# EAGLE design schematic (EAGLE 7.5.0)
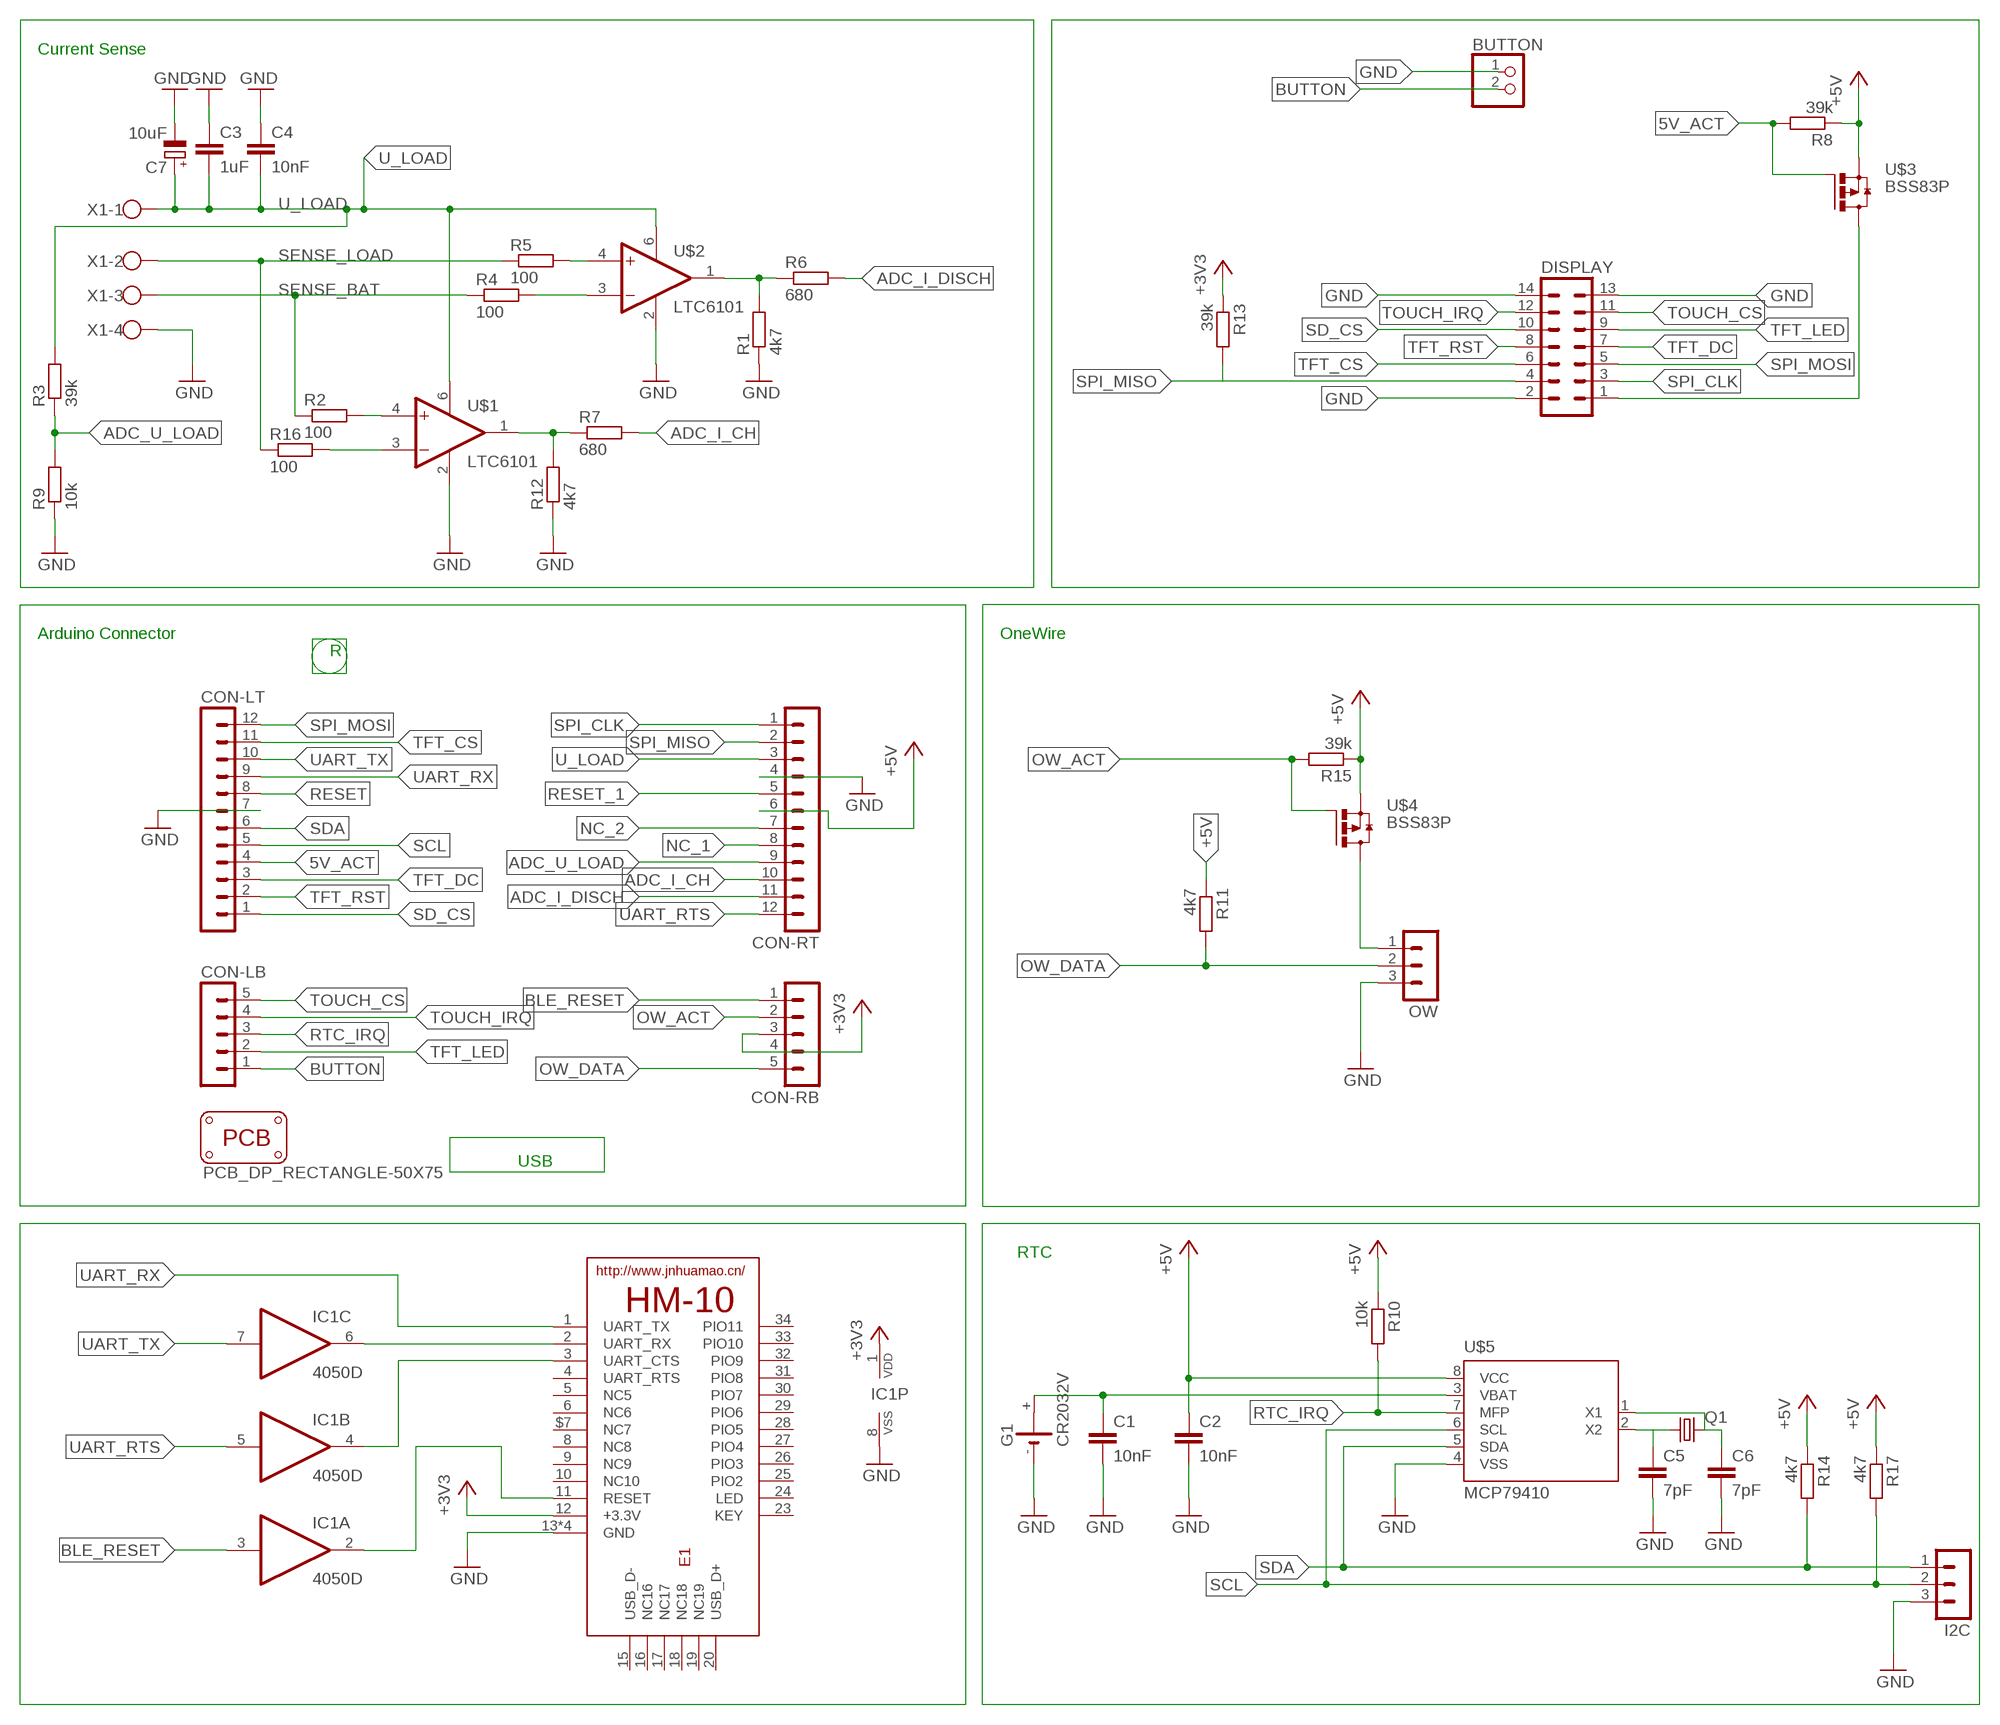
[diagram p0: schematic, sheet 1]

## Parts
BUTTON  PINHD-1X2  [1X02]
C1  10nF  C-EUC1206  [C1206]
C2  10nF  C-EUC1206  [C1206]
C3  1uF  C-EUC1206  [C1206]
C4  10nF  C-EUC1206  [C1206]
C5  7pF  C-EUC1206  [C1206]
C6  7pF  C-EUC1206  [C1206]
C7  10uF  CPOL-EUB  [PANASONIC_B]
CON-LB  MA05-1  [MA05-1]
CON-LT  MA12-1  [MA12-1]
CON-RB  MA05-1  [MA05-1]
CON-RT  MA12-1  [MA12-1]
DISPLAY  MA07-2  [MA07-2]
E1  HM-10-BOARD  [26.9X13X2.2_BOARD]
G1  CR2032V  [CR2032V]
I2C  MA03-1  [MA03-1]
IC1  4050D  [SO16]
OW  MA03-1  [MA03-1]
PCB1  PCB_DP_RECTANGLE-50X75  [DP5075_V1]
Q1  CRYSTALTC26H  [TC26H]
R1  4k7  R-EU_R1206  [R1206]
R2  100  R-EU_R1206  [R1206]
R3  39k  R-EU_R1206  [R1206]
R4  100  R-EU_R1206  [R1206]
R5  100  R-EU_R1206  [R1206]
R6  680  R-EU_R1206  [R1206]
R7  680  R-EU_R1206  [R1206]
R8  39k  R-EU_R1206  [R1206]
R9  10k  R-EU_R1206  [R1206]
R10  10k  R-EU_R1206  [R1206]
R11  4k7  R-EU_R1206  [R1206]
R12  4k7  R-EU_R1206  [R1206]
R13  39k  R-EU_R1206  [R1206]
R14  4k7  R-EU_R1206  [R1206]
R15  39k  R-EU_R1206  [R1206]
R16  100  R-EU_R1206  [R1206]
R17  4k7  R-EU_R1206  [R1206]
U$1  LTC6101  [TSOT23-6]
U$2  LTC6101  [TSOT23-6]
U$3  BSS83P  [SOT23]
U$4  BSS83P  [SOT23]
U$5  MCP79410  [SOIC8]
X1  W237-4  [W237-4]

## Nets
5V_ACT: CON-LT.4 R8.2 U$3.1(G)
+3V3: CON-RB.3 CON-RB.4 E1.12(+3.3V) IC1.1(P:VDD) R13.1
+5V: C2.1 CON-RT.6 R8.1 R10.1 R11.1 R14.1 R15.1 R17.1 U$3.2(S) U$4.2(S) U$5.8(VCC)
ADC_I_CH: CON-RT.10 R7.2
ADC_I_CH_UNPROT: R7.1 R12.2 U$1.1(OUT1)
ADC_I_DISCH: CON-RT.11 R6.2
ADC_I_DISCH_UNPROT: R1.2 R6.1 U$2.1(OUT1)
ADC_U_LOAD: CON-RT.9 R3.1 R9.2
BLE_RESET: CON-RB.1 IC1.3(A:I)
BUTTON: BUTTON.2 CON-LB.1
GND: BUTTON.1 C1.2 C2.2 C3.1 C4.1 C5.2 C6.2 C7.- CON-LT.7 CON-RT.4 DISPLAY.2 DISPLAY.13 DISPLAY.14 E1.13(GND) E1.14(GND) E1.21(GND) E1.22(GND) G1.- I2C.3 IC1.8(P:VSS) OW.3 R1.1 R9.1 R12.1 U$1.2(V-) U$2.2(V-) U$5.4(VSS) X1.4
LCD_5V: DISPLAY.1 U$3.3(D)
N$3: R5.2 U$2.4(+IN)
N$4: R4.2 U$2.3(-IN)
N$7: R2.2 U$1.4(+IN)
N$8: R16.2 U$1.3(-IN)
N$10: E1.3(UART_CTS) IC1.4(B:O)
N$11: E1.2(UART_RX) IC1.6(C:O)
N$12: E1.11(RESET) IC1.2(A:O)
N$13: OW.1 U$4.3(D)
N$16: C5.1 Q1.1 U$5.2(X2)
N$18: C6.1 Q1.2 U$5.1(X1)
NC_1: CON-RT.8
NC_2: CON-RT.7
OW_ACT: CON-RB.2 R15.2 U$4.1(G)
OW_DATA: CON-RB.5 OW.2 R11.2
RESET: CON-LT.8
RESET_1: CON-RT.5
RTC_IRQ: CON-LB.3 R10.2 U$5.7(MFP)
SCL: CON-LT.5 I2C.2 R17.2 U$5.6(SCL)
SD_CS: CON-LT.1 DISPLAY.10
SDA: CON-LT.6 I2C.1 R14.2 U$5.5(SDA)
SENSE_BAT: R2.1 R4.1 X1.3
SENSE_LOAD: R5.1 R16.1 X1.2
SPI_CLK: CON-RT.1 DISPLAY.3
SPI_MISO: CON-RT.2 DISPLAY.4 R13.2
SPI_MOSI: CON-LT.12 DISPLAY.5
TFT_CS: CON-LT.11 DISPLAY.6
TFT_DC: CON-LT.3 DISPLAY.7
TFT_LED: CON-LB.2 DISPLAY.9
TFT_RST: CON-LT.2 DISPLAY.8
TOUCH_CS: CON-LB.5 DISPLAY.11
TOUCH_IRQ: CON-LB.4 DISPLAY.12
U_LOAD: C3.2 C4.2 C7.+ CON-RT.3 R3.2 U$1.6(V+) U$2.6(V+) X1.1
UART_RTS: CON-RT.12 IC1.5(B:I)
UART_RX: CON-LT.9 E1.1(UART_TX)
UART_TX: CON-LT.10 IC1.7(C:I)
VBAK: C1.1 G1.+ U$5.3(VBAT)
Unconnected: E1.4(UART_RTS) E1.5(NC5) E1.6(NC6) E1.8(NC8) E1.9(NC9) E1.10(NC10) E1.15(USB_D-) E1.16(NC16) E1.17(NC17) E1.18(NC18) E1.19(NC19) E1.20(USB_D+) E1.23(KEY) E1.24(LED) E1.25(PIO2) E1.26(PIO3) E1.27(PIO4) E1.28(PIO5) E1.29(PIO6) E1.30(PIO7) E1.31(PIO8) E1.32(PIO9) E1.33(PIO10) E1.34(PIO11) E1.$7(NC7) G1.+@1(+) IC1.9(D:I) IC1.10(D:O) IC1.11(E:I) IC1.12(E:O) IC1.14(F:I) IC1.15(F:O)

## Notes on the sheet
- Current Sense
- Arduino Connector | OneWire
- R
- USB
- RTC

## Library data of the parts
BUTTON = pinhead:PINHD-1X2: PIN HEADER
C1-C6 = rcl:C-EU: CAPACITOR, European symbol
C7 = rcl:CPOL-EU: POLARIZED CAPACITOR, European symbol
CON-LB CON-RB = con-lstb:MA05-1: PIN HEADER; OC_FARNELL: unknown; OC_NEWARK: unknown
CON-LT CON-RT = con-lstb:MA12-1: PIN HEADER; OC_FARNELL: unknown; OC_NEWARK: unknown
DISPLAY = con-lstb:MA07-2: PIN HEADER; OC_FARNELL: unknown; OC_NEWARK: unknown
E1 = ble:HM-10: HM Bluetooth module use TI CC2540 or CC2541, Master and slave roles in one, transmission version and remote control version and PIO state acquisition functions in one, Support the AT command modify module parameters, Convenient and flexible.
G1 = battery:CR2032V: LI BATTERY Varta
I2C OW = con-lstb:MA03-1: PIN HEADER; OC_FARNELL: unknown; OC_NEWARK: unknown
IC1 = 40xx:4050: Hex non-inverting BUFFER
PCB1 = dp_pcb:PCB_DP_RECTANGLE: Dangerous Prototypes Standard Rectangular PCB sizes
Q1 = crystal:CRYSTAL: CRYSTAL; OC_FARNELL: unknown; OC_NEWARK: unknown
R1-R17 = resistor:R-EU_: RESISTOR, European symbol
U$1 U$2 = custom_devices:LTC6101
U$3 U$4 = custom_devices:BSS83P
U$5 = custom_devices:MCP79410
X1 = con-wago-500:W237-4: WAGO SCREW CLAMP; OC_FARNELL: unknown; OC_NEWARK: unknown

## Net classes
0 default: clearance 0.205 mm

## Board
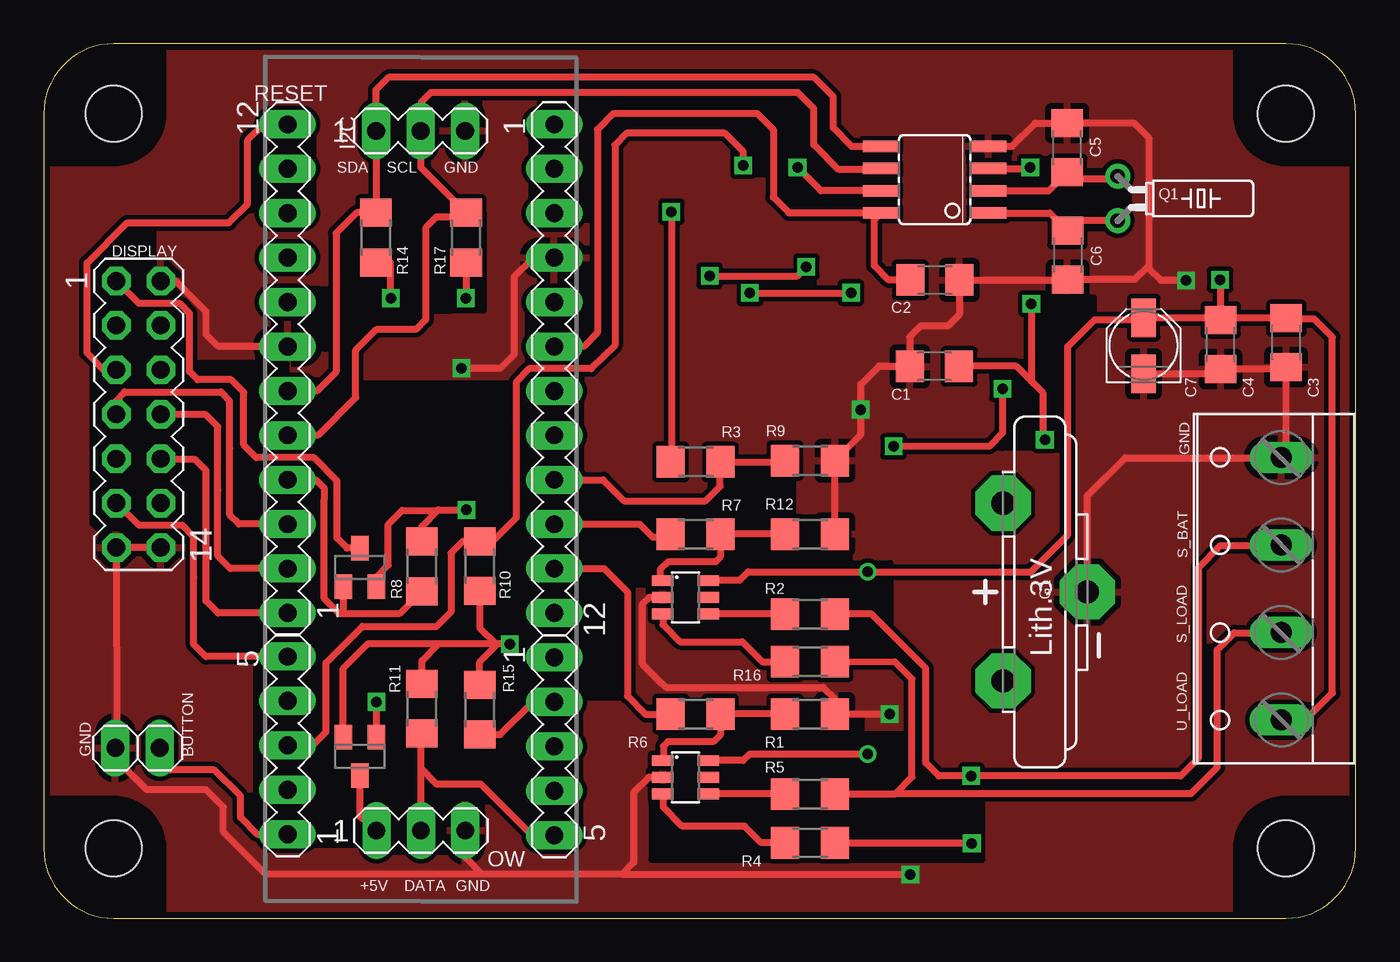
[diagram p1: board, top side]
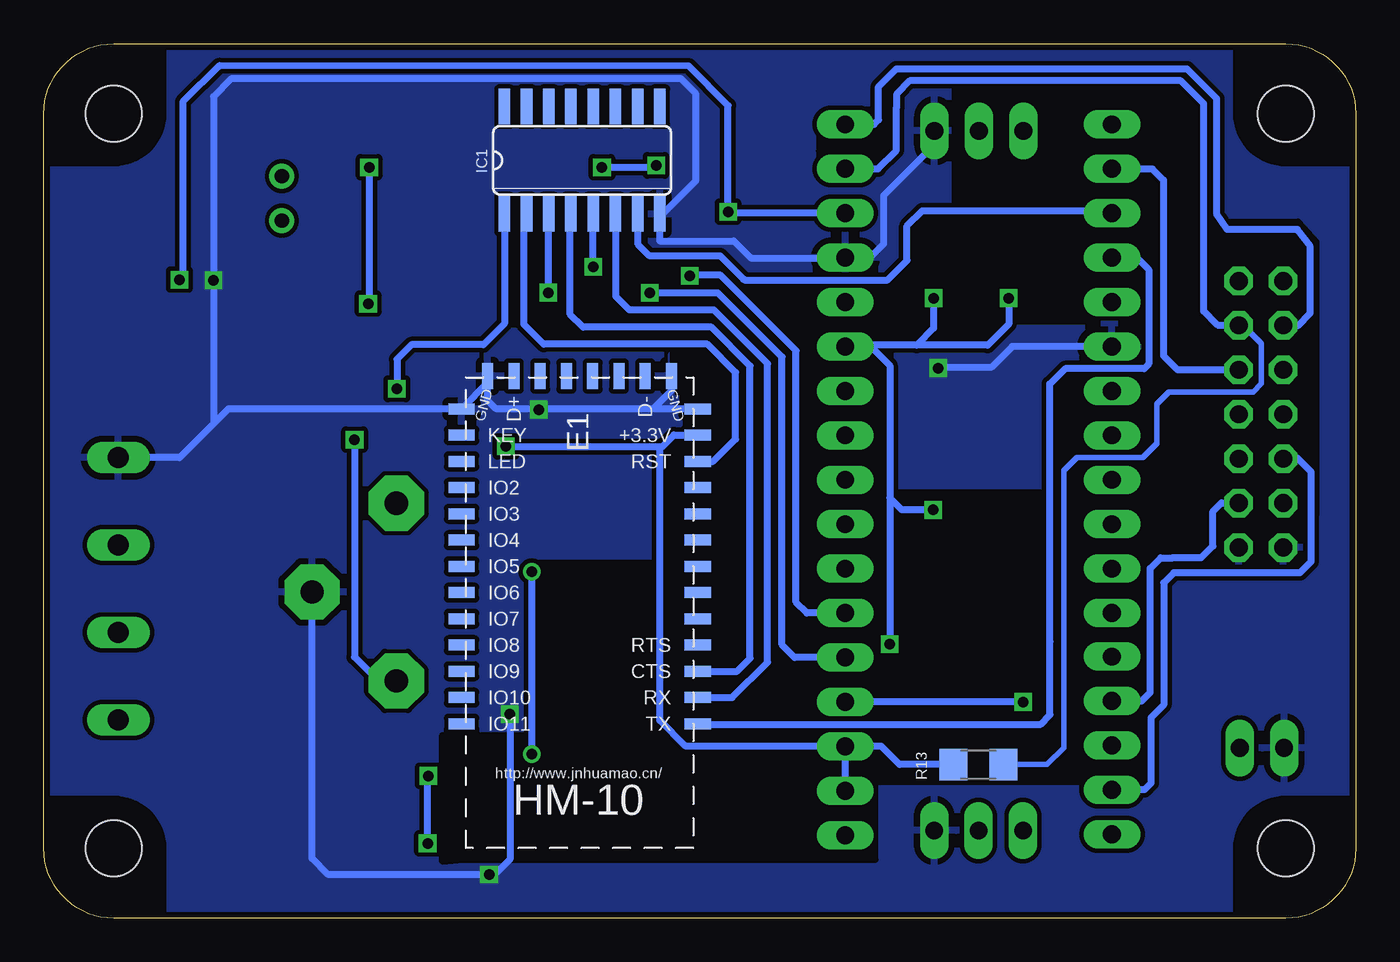
[diagram p2: board, bottom side, seen from below]

Size 75 x 50 mm. Coordinates in mm from the lower left corner, seen from the top.
Copper layers (1*16): Top 0.035mm / dielectric 1.5mm / Bottom 0.035mm
Design rules "ITEADstudio_DRC_increased": minimum track width 10mil, minimum drill 16mil, track to track 10mil, track to pad 10mil, pad to pad 10mil, via to via 10mil, smd to smd 0mil, copper to edge 14mil, drill to drill 14mil, minimum pad ring 12mil, minimum via ring 8mil, stop-mask expansion 6mil, vias tented up to drill 100mil, thermal gap 14mil
tRestrict: area 2.8,22.3 to 13.9,39.8; area 11.8,40.6 to 15.4,45.1; area 14.7,32.6 to 16.7,36; area 12.2,3.8 to 30.7,23.1; area 14.4,20.4 to 30.7,30.7; area 27.9,40.5 to 31.5,45.1; area 27.6,32.9 to 31.6,35.1; area 21.5,34.7 to 25.1,40.4; area 30.6,19.1 to 35.4,22.4; area 30.5,12.6 to 33.3,19.1; area 38.9,42.6 to 41.8,46; area 57.1,39.5 to 62,42.7; area 56.6,27.8 to 60,35.5; area 54.8,26.9 to 57.1,30.9; area 38.7,17.5 to 46,22.1; area 38.2,22 to 42.8,26.1; area 42.6,21.8 to 44.4,22.9; area 35.9,10.7 to 38.2,12.5; area 35.5,13.8 to 48.4,20.5; area 35.7,4.2 to 53.2,11.6; area 46.7,7.1 to 49.7,10.6; area 43,11.2 to 44.5,12.5; area 34.8,3.4 to 53.6,6.7
bRestrict: area 20.2,7.9 to 23.3,10.3; area 2.3,12.9 to 22.9,47.5; area 26.7,43 to 30.7,45.9; area 15.1,32.8 to 26.8,40.1; area 11.5,10.4 to 39.1,33.4; area 12,7.5 to 30.7,10.5; area 27.5,3.3 to 52.2,20.3

### Footprints (pad centres in the part's own frame; a part is rotated, then mirrored left to right if it is on the bottom)
1X02 = drill 1.016 long: 1 -1.27,0; 2 1.27,0
C1206 = smd 1.6 x 1.8: 1 -1.4,0; 2 1.4,0
PANASONIC_B = smd 2.2 x 1.4: + 1.6,0; - -1.6,0
MA05-1 = drill 1.016 long: 1 -5.08,0; 2 -2.54,0; 3 0,0; 4 2.54,0; 5 5.08,0
MA12-1 = drill 1.016 long: 1 -13.97,0; 2 -11.43,0; 3 -8.89,0; 4 -6.35,0; 5 -3.81,0; 6 -1.27,0; 7 1.27,0; 8 3.81,0; 9 6.35,0; 10 8.89,0; 11 11.43,0; 12 13.97,0
MA07-2 = drill 1.016 octagon: 1 -7.62,-1.27; 2 -7.62,1.27; 3 -5.08,-1.27; 4 -5.08,1.27; 5 -2.54,-1.27; 6 -2.54,1.27; 7 0,-1.27; 8 0,1.27; 9 2.54,-1.27; 10 2.54,1.27; 11 5.08,-1.27; 12 5.08,1.27; 13 7.62,-1.27; 14 7.62,1.27
26.9X13X2.2_BOARD = smd 1.5 x 0.635: 1 -7.5,0; 2 -7.5,-1.5; 3 -7.5,-3; 4 -7.5,-4.5; 5 -7.5,-6; 6 -7.5,-7.5; 8 -7.5,-10.5; 9 -7.5,-12; 10 -7.5,-13.5; 11 -7.5,-15; 12 -7.5,-16.5; 13 -7.5,-18; 22 6,-18; 23 6,-16.5; 24 6,-15; 25 6,-13.5; 26 6,-12; 27 6,-10.5; 28 6,-9; 29 6,-7.5; 30 6,-6; 31 6,-4.5; 32 6,-3; 33 6,-1.5; 34 6,0; $7 -7.5,-9 | smd 0.635 x 1.5: 14 -6,-19.875; 15 -4.5,-19.875; 16 -3,-19.875; 17 -1.5,-19.875; 18 0,-19.875; 19 1.5,-19.875; 20 3,-19.875; 21 4.5,-19.875
CR2032V = drill 1.321 pad 3.15 octagon: + -2.54,-5.08; +@1 -2.54,5.08; - 2.286,0
MA03-1 = drill 1.016 long: 1 -2.54,0; 2 0,0; 3 2.54,0
SO16 = smd 0.66 x 2.032: 1 -4.445,-3.073; 2 -3.175,-3.073; 3 -1.905,-3.073; 4 -0.635,-3.073; 5 0.635,-3.073; 6 1.905,-3.073; 7 3.175,-3.073; 8 4.445,-3.073; 9 4.445,3.073; 10 3.175,3.073; 11 1.905,3.073; 12 0.635,3.073; 13 -0.635,3.073; 14 -1.905,3.073; 15 -3.175,3.073; 16 -4.445,3.073
DP5075_V1 = hole 3.2: -45.53,-21.4; 21.47,-21.4; 21.47,20.6; -45.53,20.6
TC26H = drill 0.813: 1 -1.27,0; 2 1.27,0
R1206 = smd 1.6 x 1.803: 1 -1.422,0; 2 1.422,0
TSOT23-6 = smd 0.62 x 1.22: 1 -0.95,-1.3; 2 0,-1.3; 3 0.95,-1.3; 4 0.95,1.3; 5 0,1.3; 6 -0.95,1.3
SOT23 = smd 1 x 1.4: 1 -0.95,-1.1; 2 0.95,-1.1; 3 0,1.1
SOIC8 = smd 0.66 x 2.032: 1 -1.905,-3.073; 2 -0.635,-3.073; 3 0.635,-3.073; 4 1.905,-3.073; 5 1.905,3.073; 6 0.635,3.073; 7 -0.635,3.073; 8 -1.905,3.073
W237-4 = drill 1.194 long: 1 -7.5,-1.27; 2 -2.5,-1.27; 3 2.5,-1.27; 4 7.5,-1.27

### Placement (x,y rotation side)
BUTTON  5.36,9.74 0 top
C1  50.91,31.55 180 top
C2  50.94,36.49 0 top
C3  71.03,32.91 90 top
C4  67.28,32.8 90 top
C5  58.51,44.06 90 top
C6  58.52,37.91 270 top
C7  62.87,32.74 90 top
CON-LB  13.94,9.88 90 top
CON-LT  13.94,31.42 90 top
CON-RB  29.18,9.83 270 top
CON-RT  29.18,31.42 270 top
DISPLAY  5.42,28.82 270 top
E1  45.12,11.12 180 bottom
G1  57.38,18.65 0 top
I2C  21.54,45.02 0 top
IC1  44.22,43.33 0 bottom
OW  21.56,5.02 0 top
PCB1  49.53,25.4 0 top
Q1  61.39,41.15 270 top
R1  43.8,11.68 180 top
R2  43.8,17.4 180 top
R3  37.26,26.1 180 top
R4  43.8,4.32 180 top
R5  43.8,7.11 180 top
R6  37.26,11.68 180 top
R7  37.26,21.97 180 top
R8  21.62,20.12 270 top
R9  43.8,26.16 180 top
R10  24.93,20.13 90 top
R11  21.62,11.99 270 top
R12  43.8,21.97 180 top
R13  21.56,8.79 0 bottom
R14  18.98,38.92 90 top
R15  24.93,11.93 270 top
R16  43.8,14.67 180 top
R17  24.14,38.92 90 top
U$1  36.69,18.35 270 top
U$2  36.69,8.06 270 top
U$3  18.07,20.06 0 top
U$4  18.07,9.26 180 top
U$5  50.93,42.23 90 top
X1  69.46,18.83 90 top

### Tracks (layer width: path | path; a pad name or v marks a point on that pad's centre or on a via)
5V_ACT
  Top 0.406: R8.2 20.37,17.44 17.05,17.44 | CON-LT.4 13.95,25.06 15.58,25.06 16.04,24.6 16.04,23.95 16.04,18.28 16.85,17.47 16.85,17.44 17.05,17.44 | U$3.1 | 17.13,18.95 U$3.1 | U$3.1 17.12,17.51 17.05,17.44
+3V3  (via drill 0.6)
  Top 0.406: v54.81,30.27 54.81,27.75 54.05,26.98 v48.58,26.98
  Bottom 0.406: CON-RB.4 CON-RB.3 29.83,9.83 | 29.83,9.83 38.3,9.83 39.78,11.3 39.78,26.84 39.64,26.98 | 39.64,26.98 38.98,27.64 37.64,27.64 E1.12 | IC1.1 48.67,33.99 49.86,32.8 53.98,32.8 54.81,31.97 v54.81,30.27 | v48.58,26.98 39.64,26.98 | R13.1 26.07,8.79 27.13,9.84 29.82,9.84 29.83,9.83
+5V  (via drill 0.6)
  Top 0.406: v26.64,15.67 25.94,15.67 | 25.94,15.67 25.87,15.67 | 25.87,15.67 22.58,15.67 | 22.58,15.67 18.51,15.67 17.12,14.28 U$4.2 | R15.1 24.93,14.66 25.94,15.67 | R11.1 21.62,14.72 22.58,15.67 | R14.1 19.8,37.5 19.8,35.49 v19.84,35.46 | 29.21,32.66 CON-RT.6 | 49.4,35.8 C2.1 48.3,36.49 47.48,37.31 47.48,39.94 U$5.8 47.84,40.33 42.59,40.33 41.7,41.22 41.7,45.09 40.78,46.02 32.57,46.02 31.65,45.09 31.65,33.47 30.88,32.7 29.19,32.7 CON-RT.6 | R17.1 v24.14,35.46 | 22.6,23.34 22.56,23.34 21.62,22.41 R8.1 | 22.6,23.34 v24.15,23.34 | R10.1 24.93,16.61 25.87,15.67 | U$3.2 19.02,19.52 19.69,20.2 19.69,22.53 20.49,23.33 22.58,23.33 22.6,23.34 | 29.22,32.73 CON-RT.6
  Bottom 0.406: 26.64,24.04 26.64,31.61 27.72,32.69 CON-RT.6 29.1,32.77 25.1,32.77 | 26.64,24.04 v26.64,15.67 | v19.84,35.46 19.84,33.96 21.03,32.77 25.1,32.77 | v24.14,35.46 24.14,33.73 25.1,32.77 | v24.15,23.34 25.95,23.34 26.64,24.04
ADC_I_CH
  Top 0.406: 35.27,21.4 R7.2 35.66,21.79 34.8,21.79 34.07,22.53 CON-RT.10
ADC_I_CH_UNPROT
  Top 0.406: R12.2 R7.1 38.68,20.66 38.41,20.38 35.69,20.38 35.23,19.94 35.23,19.46 U$1.1
ADC_I_DISCH
  Top 0.406: R6.2 35.8,11.64 34.43,11.64 33.36,12.71 33.36,18.66 32.03,19.99 CON-RT.11
ADC_I_DISCH_UNPROT
  Top 0.406: R1.2 R6.1 38.68,10.5 38.28,10.09 35.67,10.09 35.42,9.84 35.42,9.04 U$2.1
ADC_U_LOAD
  Top 0.406: R9.2 42.32,26.1 R3.1 38.66,26.07 38.66,24.7 37.83,23.87 33.18,23.87 31.98,25.07 CON-RT.9
BLE_RESET  (via drill 0.6)
  Top 0.406: v40.36,35.75 46.08,35.75 v46.15,35.77
  Bottom 0.406: CON-RB.1 32.07,14.91 32.79,15.63 32.79,32.1 36.46,35.75 v40.36,35.75 | v46.15,35.77 46.15,40.24 IC1.3
BUTTON
  Top 0.406: CON-LB.1 12.2,4.8 11.25,5.76 11.25,6.99 9.75,8.48 7.22,8.48 6.68,9.02 6.68,9.69 BUTTON.2
GND  (via drill 0.6)
  Top 0.406: R12.1 R9.1 46.71,27.65 v46.71,29.08 46.71,30.52 47.77,31.58 49.48,31.58 C1.2 49.5,31.56 49.5,33.25 50.12,33.87 51.68,33.87 52.34,34.52 C2.2 58.5,36.49 C6.2 58.53,36.52 62.36,36.52 63.13,37.3 | G1.- 59.67,24.17 61.82,26.33 X1.4 71.04,26.64 C3.1 70.92,31.4 C4.1 67.02,31.14 C7.- | 53.93,44.2 U$5.4 55.35,44.13 56.69,45.46 C5.2 | 58.57,45.4 C5.2 | CON-RT.4 29.08,37.67 27.87,37.67 26.91,36.7 26.91,32.25 26.11,31.46 v23.87,31.46 | DISPLAY.14 DISPLAY.13 4.17,9.81 BUTTON.1 4.09,9.15 5.9,7.35 9.27,7.35 10.26,6.36 10.26,4.96 12.69,2.53 25.06,2.53 | C5.2 58.53,45.48 62.31,45.48 63.17,44.61 63.17,37.34 | U$1.2 34.62,18.35 34.2,17.93 34.2,14.54 35.32,13.43 35.35,13.43 35.58,13.2 44.55,13.2 45.22,12.53 R1.1 | R1.1 | R1.1 48.34,11.68 v48.36,11.67 | U$2.2 34.59,8.06 33.72,7.19 33.72,3.2 33.05,2.53 | 33.05,2.53 25.06,2.53 | 25.06,2.53 24.13,3.45 24.13,4.98 OW.3 | 33.05,2.53 49.51,2.53 v49.54,2.49 | 63.17,37.34 63.13,37.3 | 63.13,37.3 63.13,37.25 | 63.17,37.34 63.17,37.15 63.84,36.47 v65.29,36.47 | DISPLAY.2 7.54,36.44 9.27,34.71 9.27,33.39 9.94,32.71 13.91,32.71 CON-LT.7
  Bottom 0.406: I2C.3 24.08,44.24 27,41.32 27,38.55 27.87,37.67 29.08,37.67 CON-RT.4 | CON-LT.7 19.63,32.69 20.83,31.49 23.84,31.49 v23.87,31.46 | 29.2,37.79 CON-RT.4 | E1.13 40.18,29.12 | 51.58,29.03 51.65,29.03 51.56,29.12 E1.22 | E1.14 39.12,30.17 40.18,29.12 | IC1.8 39.78,40.11 | 29.28,37.67 CON-RT.4 | CON-RT.4 29.2,37.75 34.58,37.75 35.56,38.72 39.78,38.72 39.78,40.11 | v48.36,11.67 48.36,3.36 49.22,2.49 v49.54,2.49 58.74,2.49 59.67,3.42 G1.- | 39.78,40.11 37.73,42.16 37.73,47.14 38.61,48.02 64.25,48.02 65.29,46.98 v65.29,36.47 65.29,28.27 65.78,27.79 | X1.4 67.23,26.33 64.45,29.12 E1.22 | 40.18,29.12 46.56,29.12 | 46.56,29.12 49.14,29.12 49.62,29.61 E1.21 49.62,30.62 E1.22 | v46.71,29.08 46.6,29.08 46.56,29.12
  pour Bottom: -17.6,-12.42 93.05,-12.42 93.05,65.95 -17.86,65.95
  pour Top: -15.35,61.95 -15.35,-9.42 90.31,-9.42 90.31,62.46
LCD_5V
  Top 0.406: U$3.3 17.33,21.16 16.76,21.73 16.76,25.01 15.44,26.34 12.15,26.34 11.43,27.06 11.43,30.07 10.71,30.8 8.79,30.8 8.33,31.25 8.33,34.58 7.76,35.17 5.43,35.17 DISPLAY.1
N$3
  Top 0.406: R5.2 U$2.4
N$4
  Top 0.406: R4.2 41.01,4.32 40.07,5.27 36.5,5.27 35.42,6.35 35.42,7.08 U$2.3
N$7
  Top 0.406: R2.2 U$1.4
N$8
  Top 0.406: U$1.3 35.39,16.79 36.37,15.81 39.93,15.81 41.07,14.67 R16.2
N$10
  Bottom 0.406: E1.3 35.36,14.12 34.62,14.86 34.62,31.58 36.82,33.79 44.17,33.79 44.91,34.52 44.91,40.21 IC1.4
N$11
  Bottom 0.406: E1.2 35.65,12.62 33.62,14.64 33.62,31.71 36.69,34.78 41.52,34.78 42.29,35.55 42.29,40.23 IC1.6
N$12
  Bottom 0.406: E1.11 36.73,26.12 35.45,27.4 35.45,31.2 37.07,32.82 46.42,32.82 47.55,33.95 47.55,40.11 IC1.2
N$13
  Top 0.406: U$4.3 18.07,5.83 OW.1
N$16
  Top 0.406: U$5.2 57.45,41.59 C5.1 58.87,42.3 61.26,42.3 Q1.1
N$18
  Top 0.406: Q1.2 59.09,39.88 C6.1 57.51,40.32 U$5.1
OW_ACT  (via drill 0.6)
  Top 0.406: R15.2 26.09,10.5 27.97,12.37 CON-RB.2 | U$4.1 v19.02,12.37
  Bottom 0.406: v19.02,12.37 CON-RB.2
OW_DATA
  Top 0.406: CON-RB.5 27.91,4.75 24.99,7.67 22.45,7.67 21.56,8.56 | 21.94,10.44 R11.2 21.56,10.5 21.56,8.56 | OW.2 21.56,8.56
RTC_IRQ  (via drill 0.6)
  Top 0.406: U$5.7 44.43,41.59 v43.09,42.93 | v39.99,43.05 39.99,43.82 38.94,44.87 33.31,44.87 32.64,44.21 32.64,32.74 31.29,31.42 27.75,31.42 27.01,30.65 27.01,22.89 25.57,21.45 25.03,21.45 R10.2 23.95,21.55 23.28,20.88 23.28,17.51 22.46,16.69 18.23,16.69 16.14,14.6 16.14,10.65 15.37,9.88 CON-LB.3
  Bottom 0.406: v43.09,42.93 40.1,42.93 v39.99,43.05
SCL
  Top 0.406: I2C.2 21.55,42.94 R17.2 23.91,40.11 22.45,40.11 21.83,39.48 21.83,34.22 21.28,33.67 20.75,33.67 20.74,33.68 19.03,33.68 17.84,32.48 17.84,29.77 15.7,27.63 13.96,27.63 CON-LT.5 | 21.53,45.43 I2C.2 | U$5.6 47.83,42.84 45.41,42.84 44.03,44.22 44.03,46.29 43.1,47.21 22.12,47.21 21.58,46.67 21.58,45.05 I2C.2
SD_CS
  Top 0.406: DISPLAY.10 6.74,26.22 8.67,26.22 9.28,25.6 9.28,18.14 9.97,17.45 CON-LT.1
SDA
  Top 0.406: CON-LT.6 15.62,30.15 16.71,31.24 16.71,39.17 17.89,40.34 R14.2 19.01,40.36 I2C.1 18.98,45.44 18.98,47.35 19.72,48.08 44.03,48.08 45.13,46.97 45.13,45.19 46.19,44.13 U$5.5
SENSE_BAT  (via drill 0.6)
  Top 0.406: R2.1 47.32,17.4 50.42,14.29 50.42,8.88 51.16,8.14 52.9,8.14 v53.02,8.14 64.99,8.14 66.02,9.17 66.02,20.07 67.26,21.3 70.7,21.3 X1.3 | R4.1 53.03,4.32 v53.06,4.28
  Bottom 0.406: v53.06,4.28 53.06,8.11 v53.02,8.14
SENSE_LOAD
  Top 0.406: R16.1 48.64,14.68 49.64,13.68 49.64,8.07 48.71,7.14 | R5.1 48.68,7.11 48.71,7.14 | 48.71,7.14 65.59,7.14 67.08,8.62 67.08,15.35 68.05,16.32 70.72,16.32 X1.2
SPI_CLK
  Bottom 0.406: 29.16,45.41 CON-RT.1 27.53,45.39 27.27,45.65 27.27,47.55 26.26,48.57 9.64,48.57 7.96,46.87 7.96,40.3 7.36,39.38 3.34,39.38 2.61,38.42 2.61,34.59 3.27,33.9 DISPLAY.3
SPI_MISO
  Bottom 0.305: DISPLAY.4 6.43,33.9 5.4,32.87 5.4,30.57 5.87,30.1 10.69,30.1 11.38,29.41 11.38,27.14 12.17,26.35 15.94,26.35 16.69,25.6 16.69,9.75 17.65,8.79 R13.2
  Bottom 0.406: CON-RT.2 27.31,42.85 26.26,43.9 26.26,46.34 26.25,46.35 26.25,47.1 25.51,47.87 9.99,47.87 8.69,46.58 8.69,34.7 7.91,33.92 6.71,33.92 DISPLAY.4
SPI_MOSI
  Top 0.406: DISPLAY.5 3.44,31.36 2.48,32.32 2.48,37.46 4.78,39.76 10.57,39.76 11.65,40.84 11.67,44.51 12.51,45.35 13.9,45.35 CON-LT.12
TFT_CS
  Bottom 0.406: DISPLAY.6 10.19,31.36 10.99,32.16 10.99,42.21 11.63,42.84 CON-LT.11
TFT_DC
  Top 0.406: DISPLAY.7 4.13,28.83 4.13,29.57 4.63,30.09 10.14,30.09 10.63,29.57 10.63,26.88 10.63,23.06 11.16,22.53 CON-LT.3
TFT_LED
  Bottom 0.406: CON-LB.2 13.93,7.35 12.08,7.35 11.71,7.72 11.71,11.47 10.98,12.2 10.98,19.18 10.41,19.75 3.2,19.75 2.55,20.4 2.55,25.51 3.35,26.31 4.11,26.31 DISPLAY.9
TFT_RST
  Top 0.406: DISPLAY.8 6.72,28.79 9.27,28.79 9.95,28.11 9.95,24.49 9.96,24.48 9.96,20.7 10.67,19.99 CON-LT.2
TOUCH_CS
  Top 0.406: DISPLAY.11 5.45,22.47 7.94,22.47 8.58,21.79 8.58,19.48 8.59,19.47 8.59,15.65 9.27,14.96 CON-LB.5
TOUCH_IRQ
  Bottom 0.406: CON-LB.4 12.24,12.42 11.75,12.91 11.75,20.01 11.15,20.61 10.46,20.61 8.83,20.61 8.16,21.28 8.16,23.27 7.68,23.75 6.7,23.75 DISPLAY.12
U_LOAD  (via drill 0.6)
  Top 0.406: v47.1,9.4 40.36,9.4 39.98,9.02 U$2.6 | X1.1 72.11,11.33 73.67,12.89 | 73.67,12.89 | 71.13,34.21 C3.2 | 70.72,34.62 C3.2 | C4.2 67.14,34.34 C7.+ 62.76,34.23 60.08,34.23 58.54,32.69 58.54,21.93 56.42,19.81 v47.1,19.81 40.27,19.81 39.78,19.32 38.01,19.32 U$1.6 | C3.2 70.51,34.31 | 70.51,34.31 67.39,34.31 C4.2 | 73.67,12.89 73.67,33.22 72.62,34.27 70.55,34.27 70.51,34.31 | v35.88,40.39 35.88,26.13 R3.2 | v67.24,36.51 67.24,34.24 C4.2
  Bottom 0.406: v47.1,19.81 v47.1,9.4 | CON-RT.3 35.8,40.31 v35.88,40.39 35.88,46.46 38.12,48.72 64.91,48.73 64.98,48.73 67.04,46.67 67.04,36.71 v67.24,36.51 67.26,36.53
UART_RTS  (via drill 0.6)
  Top 0.406: v38.07,36.73 43.08,36.73 v43.6,37.24
  Bottom 0.406: CON-RT.12 31.38,17.45 31.99,18.06 31.99,32.45 36.31,36.76 38.03,36.76 v38.07,36.73 | v43.6,37.24 IC1.5
UART_RX
  Bottom 0.406: 17.49,12.19 17.49,15.82 | 17.49,15.82 17.49,30.56 16.61,31.42 12.09,31.42 11.83,31.69 11.83,37.09 12.51,37.77 CON-LT.9 | E1.1 37.6,11.1 18.01,11.1 17.48,11.63 17.48,15.81 17.49,15.82
UART_TX
  Bottom 0.406: CON-LT.10 14.09,40.46 24.79,40.46 25.65,39.6 25.65,37.61 26.76,36.5 34.95,36.5 34.95,36.54 35,36.54 36.32,37.86 40.36,37.86 41.03,38.53 41.03,40.24 IC1.7
VBAK  (via drill 0.6)
  Top 0.406: 53.95,42.91 U$5.3 56.33,42.86 v56.4,42.93 | v57.23,27.36 57.11,27.48 57.11,30.05 56.56,30.6 56.45,30.71 | 56.45,30.71 55.59,31.57 52.33,31.57 C1.1 | v56.45,35.14 56.45,30.71
  Bottom 0.406: v57.23,27.36 57.23,14.93 55.86,13.56 54.85,13.56 G1.+ | v56.4,42.93 56.4,35.19 v56.45,35.14

### Text on the board
tNames: RESET | SDA | SCL | GND | GND | S_BAT | S_LOAD | U_LOAD | GND | +5V | DATA | GND